# Altium schematic sheet Attenuator_Proto.SchDoc
size Letter; DocumentNumber: 1; SheetNumber: 1; SheetTotal: 2
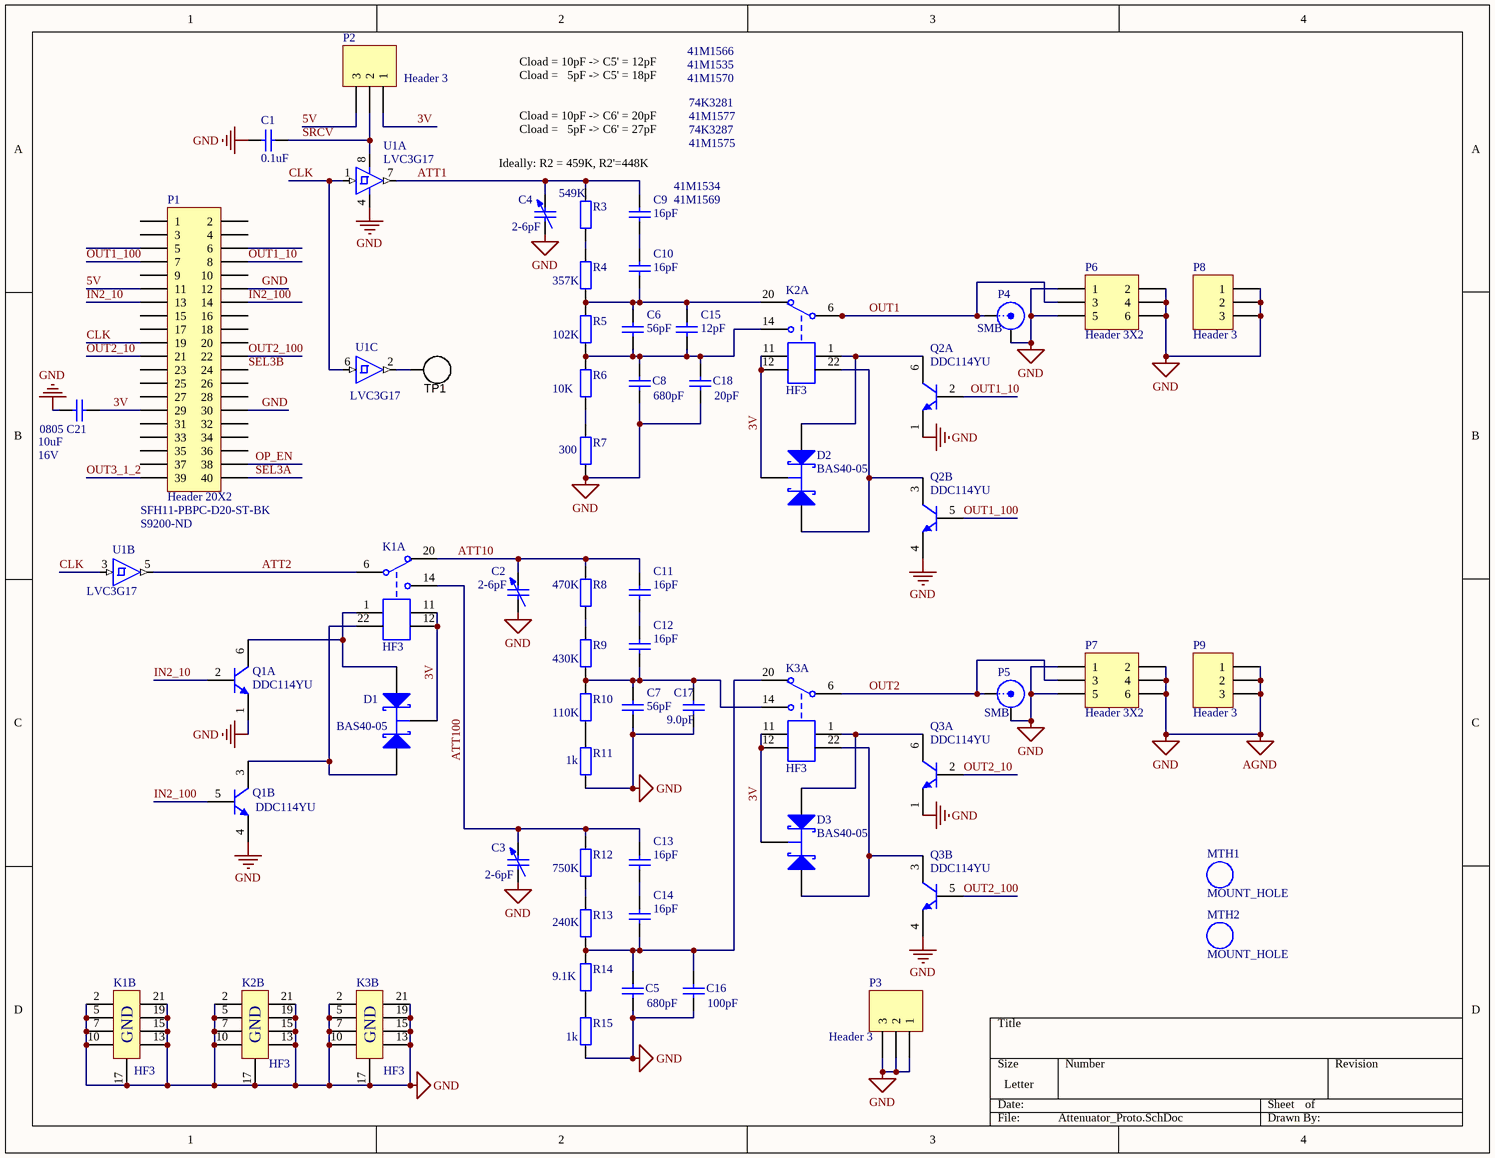
[diagram p0: Attenuator_Proto.SchDoc]

## Parts
C1  value 0.1uF  [C0805]  (hidden comment: Cap)
C2  value 2-6pF  [CAPC3225N]  (hidden comment: Cap Var)
C3  value 2-6pF  [CAPC3225N]  (hidden comment: Cap Var)
C4  value 2-6pF  [CAPC3225N]  (hidden comment: Cap Var)
C5  value 680pF  [c0805]  (hidden comment: Cap)
C6  value 56pF  [c0805]  (hidden comment: Cap)
C7  value 56pF  [c0805]  (hidden comment: Cap)
C8  value 680pF  [c0805]  (hidden comment: Cap)
C9  value 16pF  Supplier Part Number 1: 41M1569  Supplier Part Number 2: 41M1534  [c0805]  (hidden comment: Cap)
C10  value 16pF  [c0805]  (hidden comment: Cap)
C11  value 16pF  [c0805]  (hidden comment: Cap)
C12  value 16pF  [c0805]  (hidden comment: Cap)
C13  value 16pF  [c0805]  (hidden comment: Cap)
C14  value 16pF  [c0805]  (hidden comment: Cap)
C15  value 12pF  Supplier Part Number 2: 41M1570  Supplier Part Number 1: 41M1535  Supplier Part Number 3: 41M1566  [c0805]  (hidden comment: Cap)
C16  value 100pF  [c0805]  (hidden comment: Cap)
C17  value 9.0pF  [c0805]  (hidden comment: Cap)
C18  value 20pF  Supplier Part Number 1: 41M1575  Supplier Part Number 2: 74K3287  Supplier Part Number 3: 41M1577  Supplier Part Number 4: 74K3281  [c0805]  (hidden comment: Cap)
C21  value 10uF  PackageReference: 0805  Voltage: 16V  [CAPC2512L]  (hidden comment: Cap Semi)
D1  BAS40-05  [SOT-23]
D2  BAS40-05  [SOT-23]
D3  BAS40-05  [SOT-23]
K1  PartNumber: HF3  [HF3-75_Ohm]  (hidden comment: HF3_2coils_latching)  (parts A,B of 2)
K2  PartNumber: HF3  [HF3-75_Ohm]  (hidden comment: HF3_2coils_latching)  (parts A,B of 2)
K3  PartNumber: HF3  [HF3-75_Ohm]  (hidden comment: HF3_2coils_latching)  (parts A,B of 2)
MTH1  MOUNT_HOLE  [MTHOLE_UEG_EU_BE]  (no BOM)
MTH2  MOUNT_HOLE  [MTHOLE_UEG_EU_BE]  (no BOM)
P1  Header 20X2  PartNumber: SFH11-PBPC-D20-ST-BK  Supplier Part Number 1: S9200-ND  [HDR2X20]
P2  Header 3  [HDR1X3]
P3  Header 3  [HDR1X3]
P4  SMB  [SMB_V-RJ45]
P5  SMB  [SMB_V-RJ45]
P6  Header 3X2  [HDR2X3]
P7  Header 3X2  [HDR2X3]
P8  Header 3  [HDR1X3]
P9  Header 3  [HDR1X3]
Q1  PartNumber: DDC114YU  [SOT-363]  (hidden comment: DDCxxxxU)  (parts A,B of 2)
Q2  PartNumber: DDC114YU  [SOT-363]  (hidden comment: DDCxxxxU)  (parts A,B of 2)
Q3  PartNumber: DDC114YU  [SOT-363]  (hidden comment: DDCxxxxU)  (parts A,B of 2)
R3  value 549K  [0805]  (hidden comment: Res2)
R4  value 357K  [0805]  (hidden comment: Res2)
R5  value 102K  [0805]  (hidden comment: Res2)
R6  value 10K  [0805]  (hidden comment: Res2)
R7  value 300  [0805]  (hidden comment: Res2)
R8  value 470K  [0805]  (hidden comment: Res2)
R9  value 430K  [0805]  (hidden comment: Res2)
R10  value 110K  [0805]  (hidden comment: Res2)
R11  value 1k  [0805]  (hidden comment: Res2)
R12  value 750K  [0805]  (hidden comment: Res2)
R13  value 240K  [0805]  (hidden comment: Res2)
R14  value 9.1K  [0805]  (hidden comment: Res2)
R15  value 1k  [0805]  (hidden comment: Res2)
TP1  TESTPOINT  [TESTPOINT]  (value not drawn)  (no BOM)
U1  value LVC3G17  [sm8]  (hidden comment: SN74LVC3G17DCTR)  (parts A,B,C of 3)

## Nets
GND: C1.2 C2.1 C3.1 C4.1 C5.1 C7.1 C8.1 C16.1 C17.1 C18.1 C21.2 K1.2(GND) K1.5(GND) K1.7(GND) K1.10(GND) K1.13(GND) K1.15(GND) K1.17(GND) K1.19(GND) K1.21(GND) K2.2(GND) K2.5(GND) K2.7(GND) K2.10(GND) K2.13(GND) K2.15(GND) K2.17(GND) K2.19(GND) K2.21(GND) K3.2(GND) K3.5(GND) K3.7(GND) K3.10(GND) K3.13(GND) K3.15(GND) K3.17(GND) K3.19(GND) K3.21(GND) P1.12 P1.30 P3.1 P3.2 P3.3 P4.2(Y) P5.2(Y) P6.1 P6.2 P6.4 P6.5 P6.6 P7.1 P7.2 P7.4 P7.5 P7.6 P8.1 P8.2 P8.3 P9.1 P9.2 P9.3 Q1.1(E) Q1.4(E) Q2.1(E) Q2.4(E) Q3.1(E) Q3.4(E) R7.1 R11.1 R15.1 U1.4(GND)  [also labelled AGND]
3V: C21.1 D1.3(K) D2.3(K) D3.3(K) K1.11 K1.12 K2.11 K2.12 K3.11 K3.12 P1.29 P2.1
5V: P1.11 P2.3
ATT1: C4.2 C9.2 R3.2 U1.7(1Y)
ATT2: K1.6 U1.5(2Y)
ATT10: C2.2 C11.2 K1.20 R8.2
ATT100: C3.2 C13.2 K1.14 R12.2
CLK: P1.19 U1.1(1A) U1.3(2A) U1.6(3A)
IN2_10: P1.13 Q1.2(B)
IN2_100: P1.14 Q1.5(B)
OP_EN: P1.38
OUT1: K2.6 P4.1(X) P6.3
OUT1_10: P1.8 Q2.2(B)
OUT1_100: P1.7 Q2.5(B)
OUT2: K3.6 P5.1(X) P7.3
OUT2_10: P1.21 Q3.2(B)
OUT2_100: P1.22 Q3.5(B)
OUT3_1_2: P1.39
SEL3A: P1.40
SEL3B: P1.24
SRCV: C1.1 P2.2 U1.8(VCC)
NetC5_2: C5.2 C14.1 C16.2 K3.20 R13.1 R14.2
NetC6_1: C6.1 C8.2 C15.1 C18.2 K2.14 R5.1 R6.2
NetC6_2: C6.2 C10.1 C15.2 K2.20 R4.1 R5.2
NetC7_2: C7.2 C12.1 C17.2 K3.14 R9.1 R10.2
NetC9_1: C9.1 C10.2
NetC11_1: C11.1 C12.2
NetC13_1: C13.1 C14.2
NetD1_1: D1.1(A1) K1.1 Q1.6(C)
NetD1_2: D1.2(A2) K1.22 Q1.3(C)
NetD2_1: D2.1(A1) K2.1 Q2.6(C)
NetD2_2: D2.2(A2) K2.22 Q2.3(C)
NetD3_1: D3.1(A1) K3.1 Q3.6(C)
NetD3_2: D3.2(A2) K3.22 Q3.3(C)
NetR3_1: R3.1 R4.2
NetR6_1: R6.1 R7.2
NetR8_1: R8.1 R9.2
NetR10_1: R10.1 R11.2
NetR12_1: R12.1 R13.2
NetR14_1: R14.1 R15.2
NetTP1_1: TP1.1 U1.2(3Y)

Not connected (* = marked no-connect by the designer): P1 1 2 3 4 5 6 9 10 15 16 17 18 20 23 25 26 27 28 31 32 33 34 35 36 37

## Notes on the sheet
- Cload = 10pF -> C5' = 12pF
  Cload =   5pF -> C5' = 18pF
- Ideally: R2 = 459K, R2'=448K
- Cload = 10pF -> C6' = 20pF
  Cload =   5pF -> C6' = 27pF

## Library data of the parts
C1 C5-C18 = Cap: Capacitor; Published: 8-Jun-2000; LatestRevisionDate: 17-Jul-2002; LatestRevisionNote: Re-released for DXP Platform.; PackageReference: RAD-0.3; Publisher: Altium Limited
  C1: Supplier 1: Newark; Supplier Part Number 1: 06R3744
  C5 C8: Supplier 1: Newark; Supplier Part Number 1: 46WX121
  C6 C7: Supplier 1: Newark; Supplier Part Number 1: 41M1546
  C9: Supplier 1: Newark; Supplier 2: Newark
  C10-C14: Supplier 1: Newark; Supplier Part Number 1: 41M1569; Supplier 2: Newark; Supplier Part Number 2: 41M1534
  C15: Supplier 1: Newark; Supplier 2: Newark; Supplier 3: Newark
  C18: Supplier 1: Newark; Supplier 2: Newark; Supplier 3: Newark; Supplier 4: Newark
C2-C4 = Cap Var: Variable or Adjustable Capacitor; Published: 24-Mar-1999; LatestRevisionDate: 29-May-2009; LatestRevisionNote: IPC-7351 Footprint Added.; PackageReference: C1210; Publisher: Altium Limited; PackageDescription: Chip Capacitor 1210 Case Size; Code_JEITA: 1210; Code_IPC: CAPC3225; Supplier 1: Digi-Key; Supplier Part Number 1: 490-2001-1-ND
C21 = Cap Semi: Capacitor (Semiconductor SIM Model); Manufacturer: Murata; PartNumber: GRM21BF51C106ZE15L; Published: 8-Jun-2000; LatestRevisionDate: 29-May-2009; LatestRevisionNote: IPC-7351 Footprint Added.; Publisher: Altium Limited; PackageDescription: Chip Capacitor; RoHS: Yes; CompType: Cap; Supplier 1: Digi-Key; Supplier Part Number 1: 490-3347-1-ND
D1-D3 = BAS40-05: Silicon AF Schottky Diode for High-Speed Switching; Published: 21-Mar-2003; DatasheetDocument: Oct-1999; PackageDocument: Sep-2001; PackageReference: SOT-23; Publisher: Altium Limited; ComponentLink1Description: Manufacturer Link; ComponentLink1URL: http://www.infineon.com/; ComponentLink2Description: Datasheet; ComponentLink2URL: http://www.infineon.com/upload/Document/cmc_upload/documents/037/109/bas40_bas140series.pdf
K1-K3 = HF3_2coils_latching: HF3 Relay, Latching type, 2 coils; Manufacturer: Tyco Electronics
P1 = Header 20X2: Header, 20-Pin, Dual row; LatestRevisionDate: 17-Jul-2002; LatestRevisionNote: Re-released for DXP Platform.; Publisher: Altium Limited; Supplier 1: Digi-Key
P2 P3 P8 P9 = Header 3: Header, 3-Pin; LatestRevisionDate: 17-Jul-2002; LatestRevisionNote: Re-released for DXP Platform.; Publisher: Altium Limited
P4 P5 = SMB: SMB Straight Connector; LatestRevisionDate: 17-Jul-2002; LatestRevisionNote: Re-released for DXP Platform.; Publisher: Altium Limited
P6 P7 = Header 3X2: Header, 3-Pin, Dual row; LatestRevisionDate: 17-Jul-2002; LatestRevisionNote: Re-released for DXP Platform.; Publisher: Altium Limited
Q1-Q3 = DDCxxxxU: NPN PRE-BIASED SMALL SIGNAL DUAL SURFACE MOUNT TRANSISTOR; Supplier 2: Digi-Key; Supplier Part Number 2: DDC114YU-FDICT-ND; Supplier 1: Avnet; Supplier Part Number 1: DDC114YU-7-F/BKN
R3-R15 = Res2: Resistor; Published: 8-Jun-2000; LatestRevisionDate: 17-Jul-2002; LatestRevisionNote: Re-released for DXP Platform.; PackageReference: AXIAL-0.4; Publisher: Altium Limited
  R3: Supplier 1: Digi-Key; Supplier Part Number 1: RR12P549KDCT-ND
  R4: Supplier 1: Digi-Key; Supplier Part Number 1: RR08P357KDCT-ND
  R5: Supplier 1: Digi-Key; Supplier Part Number 1: RG20P102KBCT-ND; Supplier 2: Digi-Key; Supplier Part Number 2: RR08P102KDCT-ND
  R6: Supplier 1: Digi-Key; Supplier Part Number 1: RR12P10.0KDDKR-ND
  R7: Supplier 1: Digi-Key; Supplier Part Number 1: RR12P300DCT-ND
  R8: Supplier 1: Digi-Key; Supplier Part Number 1: RR12P470KDCT-ND
  R9: Supplier 1: Digi-Key; Supplier Part Number 1: P430KCCT-ND
  R10: Supplier 1: Digi-Key; Supplier Part Number 1: RR1220P-114-D
  R11: Supplier 1: Digi-Key; Supplier Part Number 1: ERJ-6ENF1001V
  R12: Supplier 1: Digi-Key; Supplier Part Number 1: RR1220P-754-D
  R13: Supplier 1: Digi-Key; Supplier Part Number 1: RR1220P-244-D; Supplier 2: Digi-Key; Supplier Part Number 2: RR12P240KDCT-ND
  R14: Supplier 2: Digi-Key; Supplier Part Number 2: RR12P9.1KDCT-ND
  R15: Supplier 1: Digi-Key; Supplier Part Number 1: ERJ-6ENF1001V; Supplier 2: Digi-Key; Supplier Part Number 2: P1.00KCCT-ND
TP1 = TESTPOINT: TEST POINT.  No entry in BOM.; SymbolVersion: 2009-02-23; CompType: Testpoint; Manufacturer: *; PartNumber: *; RoHS: Yes; CompType: *
U1 = SN74LVC3G17DCTR: Manufacturer: Texas Instruments; Supplier 1: Newark; Supplier 2: Digi-Key; Supplier Part Number 1: 90H3713; Supplier Part Number 2: 296-16915-1-ND; Manufacturer Part Number: SN74LVC3G17DCTR